# Altium project panel_led.PrjPcb
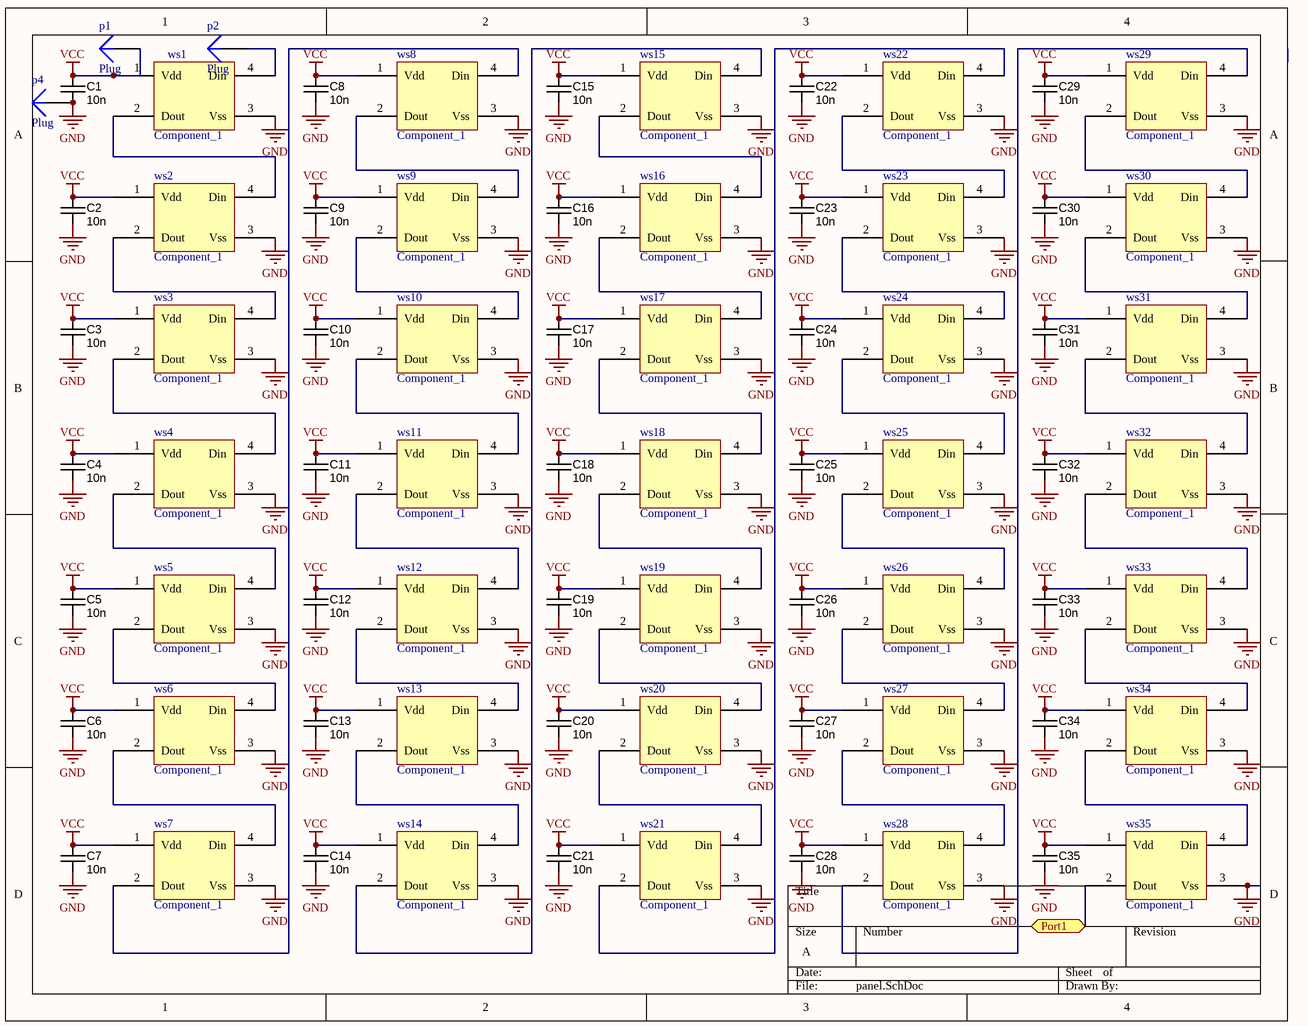
[diagram p0: panel.SchDoc]
7 sheets, 460 parts. Net scope: flat (ports and power ports of the same name join across sheets).
Board file: panel_led.PcbDoc
Sheets:
  panel.SchDoc
  panel2.SchDoc
  panel3.SchDoc
  panel4.SchDoc
  panel5.SchDoc
  panel6.SchDoc
  panel7.SchDoc

## Sheet panel.SchDoc
size A

### Parts
C1  value 10n  [CAPC1608X90N]  (hidden comment: approved sub OK)
C2  value 10n  [CAPC1608X90N]  (hidden comment: approved sub OK)
C3  value 10n  [CAPC1608X90N]  (hidden comment: approved sub OK)
C4  value 10n  [CAPC1608X90N]  (hidden comment: approved sub OK)
C5  value 10n  [CAPC1608X90N]  (hidden comment: approved sub OK)
C6  value 10n  [CAPC1608X90N]  (hidden comment: approved sub OK)
C7  value 10n  [CAPC1608X90N]  (hidden comment: approved sub OK)
C8  value 10n  [CAPC1608X90N]  (hidden comment: approved sub OK)
C9  value 10n  [CAPC1608X90N]  (hidden comment: approved sub OK)
C10  value 10n  [CAPC1608X90N]  (hidden comment: approved sub OK)
C11  value 10n  [CAPC1608X90N]  (hidden comment: approved sub OK)
C12  value 10n  [CAPC1608X90N]  (hidden comment: approved sub OK)
C13  value 10n  [CAPC1608X90N]  (hidden comment: approved sub OK)
C14  value 10n  [CAPC1608X90N]  (hidden comment: approved sub OK)
C15  value 10n  [CAPC1608X90N]  (hidden comment: approved sub OK)
C16  value 10n  [CAPC1608X90N]  (hidden comment: approved sub OK)
C17  value 10n  [CAPC1608X90N]  (hidden comment: approved sub OK)
C18  value 10n  [CAPC1608X90N]  (hidden comment: approved sub OK)
C19  value 10n  [CAPC1608X90N]  (hidden comment: approved sub OK)
C20  value 10n  [CAPC1608X90N]  (hidden comment: approved sub OK)
C21  value 10n  [CAPC1608X90N]  (hidden comment: approved sub OK)
C22  value 10n  [CAPC1608X90N]  (hidden comment: approved sub OK)
C23  value 10n  [CAPC1608X90N]  (hidden comment: approved sub OK)
C24  value 10n  [CAPC1608X90N]  (hidden comment: approved sub OK)
C25  value 10n  [CAPC1608X90N]  (hidden comment: approved sub OK)
C26  value 10n  [CAPC1608X90N]  (hidden comment: approved sub OK)
C27  value 10n  [CAPC1608X90N]  (hidden comment: approved sub OK)
C28  value 10n  [CAPC1608X90N]  (hidden comment: approved sub OK)
C29  value 10n  [CAPC1608X90N]  (hidden comment: approved sub OK)
C30  value 10n  [CAPC1608X90N]  (hidden comment: approved sub OK)
C31  value 10n  [CAPC1608X90N]  (hidden comment: approved sub OK)
C32  value 10n  [CAPC1608X90N]  (hidden comment: approved sub OK)
C33  value 10n  [CAPC1608X90N]  (hidden comment: approved sub OK)
C34  value 10n  [CAPC1608X90N]  (hidden comment: approved sub OK)
C35  value 10n  [CAPC1608X90N]  (hidden comment: approved sub OK)
p1  Plug  [PIN1]
p2  Plug  [PIN1]
p4  Plug  [PIN1]
ws1  Component_1  [SOP4]
ws2  Component_1  [SOP4]
ws3  Component_1  [SOP4]
ws4  Component_1  [SOP4]
ws5  Component_1  [SOP4]
ws6  Component_1  [SOP4]
ws7  Component_1  [SOP4]
ws8  Component_1  [SOP4]
ws9  Component_1  [SOP4]
ws10  Component_1  [SOP4]
ws11  Component_1  [SOP4]
ws12  Component_1  [SOP4]
ws13  Component_1  [SOP4]
ws14  Component_1  [SOP4]
ws15  Component_1  [SOP4]
ws16  Component_1  [SOP4]
ws17  Component_1  [SOP4]
ws18  Component_1  [SOP4]
ws19  Component_1  [SOP4]
ws20  Component_1  [SOP4]
ws21  Component_1  [SOP4]
ws22  Component_1  [SOP4]
ws23  Component_1  [SOP4]
ws24  Component_1  [SOP4]
ws25  Component_1  [SOP4]
ws26  Component_1  [SOP4]
ws27  Component_1  [SOP4]
ws28  Component_1  [SOP4]
ws29  Component_1  [SOP4]
ws30  Component_1  [SOP4]
ws31  Component_1  [SOP4]
ws32  Component_1  [SOP4]
ws33  Component_1  [SOP4]
ws34  Component_1  [SOP4]
ws35  Component_1  [SOP4]

### Ports
Port1

### Nets
GND: C1.2 C2.2 C3.2 C4.2 C5.2 C6.2 C7.2 C8.2 C9.2 C10.2 C11.2 C12.2 C13.2 C14.2 C15.2 C16.2 C17.2 C18.2 C19.2 C20.2 C21.2 C22.2 C23.2 C24.2 C25.2 C26.2 C27.2 C28.2 C29.2 C30.2 C31.2 C32.2 C33.2 C34.2 C35.2 p4.1 ws1.3(Vss) ws2.3(Vss) ws3.3(Vss) ws4.3(Vss) ws5.3(Vss) ws6.3(Vss) ws7.3(Vss) ws8.3(Vss) ws9.3(Vss) ws10.3(Vss) ws11.3(Vss) ws12.3(Vss) ws13.3(Vss) ws14.3(Vss) ws15.3(Vss) ws16.3(Vss) ws17.3(Vss) ws18.3(Vss) ws19.3(Vss) ws20.3(Vss) ws21.3(Vss) ws22.3(Vss) ws23.3(Vss) ws24.3(Vss) ws25.3(Vss) ws26.3(Vss) ws27.3(Vss) ws28.3(Vss) ws29.3(Vss) ws30.3(Vss) ws31.3(Vss) ws32.3(Vss) ws33.3(Vss) ws34.3(Vss) ws35.3(Vss)
VCC: C1.1 C2.1 C3.1 C4.1 C5.1 C6.1 C7.1 C8.1 C9.1 C10.1 C11.1 C12.1 C13.1 C14.1 C15.1 C16.1 C17.1 C18.1 C19.1 C20.1 C21.1 C22.1 C23.1 C24.1 C25.1 C26.1 C27.1 C28.1 C29.1 C30.1 C31.1 C32.1 C33.1 C34.1 C35.1 p1.1 ws1.1(Vdd) ws2.1(Vdd) ws3.1(Vdd) ws4.1(Vdd) ws5.1(Vdd) ws6.1(Vdd) ws7.1(Vdd) ws8.1(Vdd) ws9.1(Vdd) ws10.1(Vdd) ws11.1(Vdd) ws12.1(Vdd) ws13.1(Vdd) ws14.1(Vdd) ws15.1(Vdd) ws16.1(Vdd) ws17.1(Vdd) ws18.1(Vdd) ws19.1(Vdd) ws20.1(Vdd) ws21.1(Vdd) ws22.1(Vdd) ws23.1(Vdd) ws24.1(Vdd) ws25.1(Vdd) ws26.1(Vdd) ws27.1(Vdd) ws28.1(Vdd) ws29.1(Vdd) ws30.1(Vdd) ws31.1(Vdd) ws32.1(Vdd) ws33.1(Vdd) ws34.1(Vdd) ws35.1(Vdd)
Netp2_1: p2.1 ws1.4(Din)
Netws1_2: ws1.2(Dout) ws2.4(Din)
Netws2_2: ws2.2(Dout) ws3.4(Din)
Netws3_2: ws3.2(Dout) ws4.4(Din)
Netws4_2: ws4.2(Dout) ws5.4(Din)
Netws5_2: ws5.2(Dout) ws6.4(Din)
Netws6_2: ws6.2(Dout) ws7.4(Din)
Netws7_2: ws7.2(Dout) ws8.4(Din)
Netws8_2: ws8.2(Dout) ws9.4(Din)
Netws9_2: ws9.2(Dout) ws10.4(Din)
Netws10_2: ws10.2(Dout) ws11.4(Din)
Netws11_2: ws11.2(Dout) ws12.4(Din)
Netws12_2: ws12.2(Dout) ws13.4(Din)
Netws13_2: ws13.2(Dout) ws14.4(Din)
Netws14_2: ws14.2(Dout) ws15.4(Din)
Netws15_2: ws15.2(Dout) ws16.4(Din)
Netws16_2: ws16.2(Dout) ws17.4(Din)
Netws17_2: ws17.2(Dout) ws18.4(Din)
Netws18_2: ws18.2(Dout) ws19.4(Din)
Netws19_2: ws19.2(Dout) ws20.4(Din)
Netws20_2: ws20.2(Dout) ws21.4(Din)
Netws21_2: ws21.2(Dout) ws22.4(Din)
Netws22_2: ws22.2(Dout) ws23.4(Din)
Netws23_2: ws23.2(Dout) ws24.4(Din)
Netws24_2: ws24.2(Dout) ws25.4(Din)
Netws25_2: ws25.2(Dout) ws26.4(Din)
Netws26_2: ws26.2(Dout) ws27.4(Din)
Netws27_2: ws27.2(Dout) ws28.4(Din)
Netws28_2: ws28.2(Dout) ws29.4(Din)
Netws29_2: ws29.2(Dout) ws30.4(Din)
Netws30_2: ws30.2(Dout) ws31.4(Din)
Netws31_2: ws31.2(Dout) ws32.4(Din)
Netws32_2: ws32.2(Dout) ws33.4(Din)
Netws33_2: ws33.2(Dout) ws34.4(Din)
Netws34_2: ws34.2(Dout) ws35.4(Din)
Netws35_2: ws35.2(Dout) ; port Port1

### Library data of the parts
C1-C35 = CAPC_10n_0603_X7R_100V_10%: Capacitor SMD Cer 10nF 10% 100V X7R 0603; Manufacturer: Murata Electronics North America; Manufacturer Part Number: GCM188R72A103KA37D; Ratings: 100V; X7R; Material: ceramic; SCDType: undef; Package / Case: 0603 (1608 metric); Tolerance: ±10%; Supplier 1: Digi-Key; Supplier Part Number 1: 490-4781-1-ND
p1 p2 p4 = Plug: LatestRevisionDate: 17-Jul-2002; LatestRevisionNote: Re-released for DXP Platform.; Publisher: Altium Limited

## Sheet panel2.SchDoc
size A
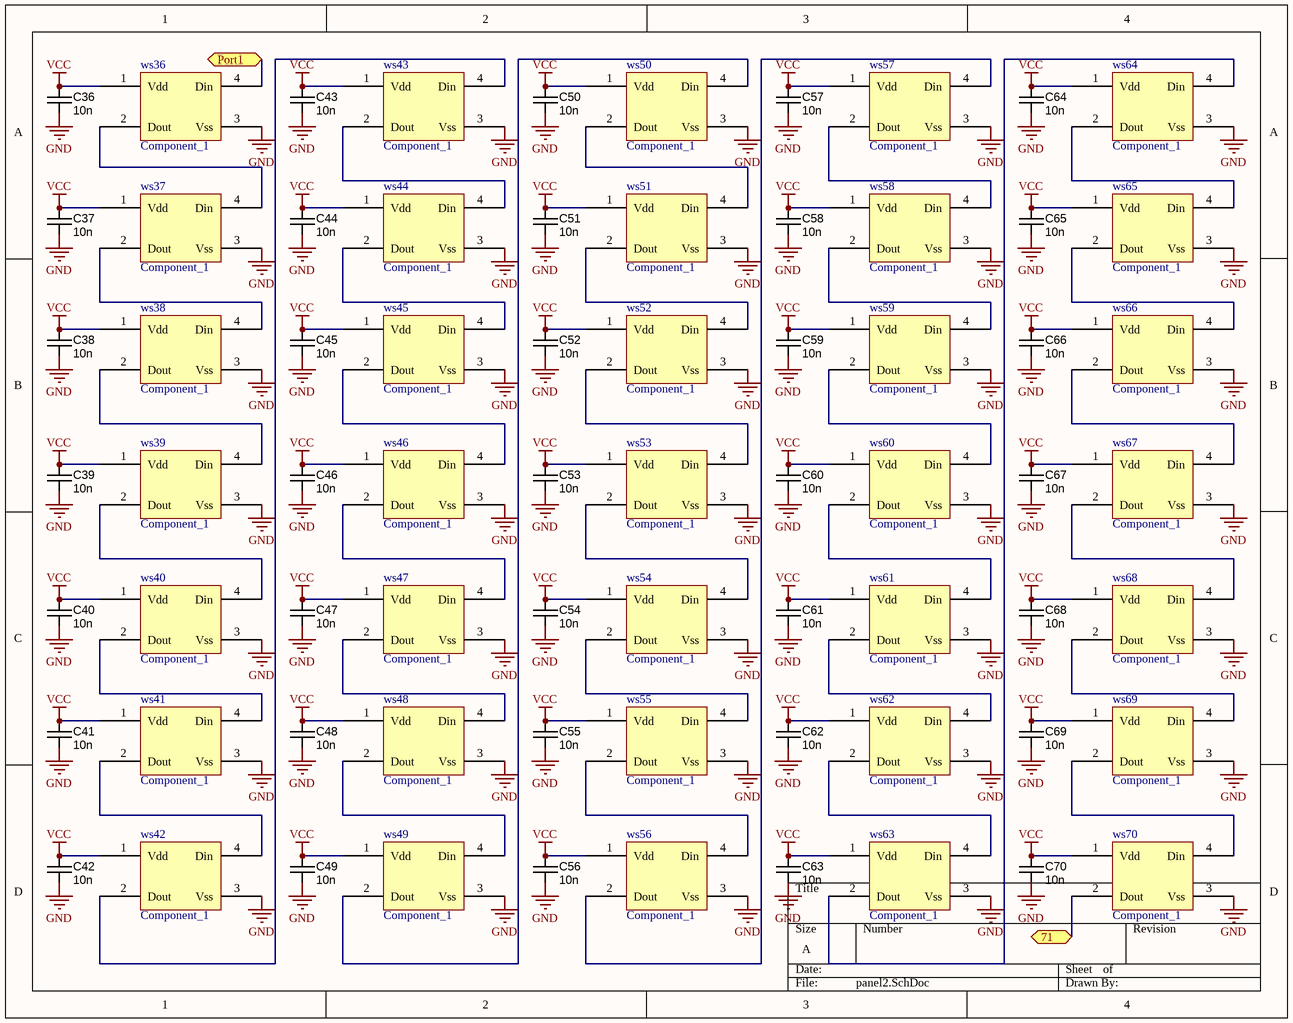
[diagram p1: panel2.SchDoc]

### Parts
C36  value 10n  [CAPC1608X90N]  (hidden comment: approved sub OK)
C37  value 10n  [CAPC1608X90N]  (hidden comment: approved sub OK)
C38  value 10n  [CAPC1608X90N]  (hidden comment: approved sub OK)
C39  value 10n  [CAPC1608X90N]  (hidden comment: approved sub OK)
C40  value 10n  [CAPC1608X90N]  (hidden comment: approved sub OK)
C41  value 10n  [CAPC1608X90N]  (hidden comment: approved sub OK)
C42  value 10n  [CAPC1608X90N]  (hidden comment: approved sub OK)
C43  value 10n  [CAPC1608X90N]  (hidden comment: approved sub OK)
C44  value 10n  [CAPC1608X90N]  (hidden comment: approved sub OK)
C45  value 10n  [CAPC1608X90N]  (hidden comment: approved sub OK)
C46  value 10n  [CAPC1608X90N]  (hidden comment: approved sub OK)
C47  value 10n  [CAPC1608X90N]  (hidden comment: approved sub OK)
C48  value 10n  [CAPC1608X90N]  (hidden comment: approved sub OK)
C49  value 10n  [CAPC1608X90N]  (hidden comment: approved sub OK)
C50  value 10n  [CAPC1608X90N]  (hidden comment: approved sub OK)
C51  value 10n  [CAPC1608X90N]  (hidden comment: approved sub OK)
C52  value 10n  [CAPC1608X90N]  (hidden comment: approved sub OK)
C53  value 10n  [CAPC1608X90N]  (hidden comment: approved sub OK)
C54  value 10n  [CAPC1608X90N]  (hidden comment: approved sub OK)
C55  value 10n  [CAPC1608X90N]  (hidden comment: approved sub OK)
C56  value 10n  [CAPC1608X90N]  (hidden comment: approved sub OK)
C57  value 10n  [CAPC1608X90N]  (hidden comment: approved sub OK)
C58  value 10n  [CAPC1608X90N]  (hidden comment: approved sub OK)
C59  value 10n  [CAPC1608X90N]  (hidden comment: approved sub OK)
C60  value 10n  [CAPC1608X90N]  (hidden comment: approved sub OK)
C61  value 10n  [CAPC1608X90N]  (hidden comment: approved sub OK)
C62  value 10n  [CAPC1608X90N]  (hidden comment: approved sub OK)
C63  value 10n  [CAPC1608X90N]  (hidden comment: approved sub OK)
C64  value 10n  [CAPC1608X90N]  (hidden comment: approved sub OK)
C65  value 10n  [CAPC1608X90N]  (hidden comment: approved sub OK)
C66  value 10n  [CAPC1608X90N]  (hidden comment: approved sub OK)
C67  value 10n  [CAPC1608X90N]  (hidden comment: approved sub OK)
C68  value 10n  [CAPC1608X90N]  (hidden comment: approved sub OK)
C69  value 10n  [CAPC1608X90N]  (hidden comment: approved sub OK)
C70  value 10n  [CAPC1608X90N]  (hidden comment: approved sub OK)
ws36  Component_1  [SOP4]
ws37  Component_1  [SOP4]
ws38  Component_1  [SOP4]
ws39  Component_1  [SOP4]
ws40  Component_1  [SOP4]
ws41  Component_1  [SOP4]
ws42  Component_1  [SOP4]
ws43  Component_1  [SOP4]
ws44  Component_1  [SOP4]
ws45  Component_1  [SOP4]
ws46  Component_1  [SOP4]
ws47  Component_1  [SOP4]
ws48  Component_1  [SOP4]
ws49  Component_1  [SOP4]
ws50  Component_1  [SOP4]
ws51  Component_1  [SOP4]
ws52  Component_1  [SOP4]
ws53  Component_1  [SOP4]
ws54  Component_1  [SOP4]
ws55  Component_1  [SOP4]
ws56  Component_1  [SOP4]
ws57  Component_1  [SOP4]
ws58  Component_1  [SOP4]
ws59  Component_1  [SOP4]
ws60  Component_1  [SOP4]
ws61  Component_1  [SOP4]
ws62  Component_1  [SOP4]
ws63  Component_1  [SOP4]
ws64  Component_1  [SOP4]
ws65  Component_1  [SOP4]
ws66  Component_1  [SOP4]
ws67  Component_1  [SOP4]
ws68  Component_1  [SOP4]
ws69  Component_1  [SOP4]
ws70  Component_1  [SOP4]

### Ports
71, Port1

### Nets
GND: C36.2 C37.2 C38.2 C39.2 C40.2 C41.2 C42.2 C43.2 C44.2 C45.2 C46.2 C47.2 C48.2 C49.2 C50.2 C51.2 C52.2 C53.2 C54.2 C55.2 C56.2 C57.2 C58.2 C59.2 C60.2 C61.2 C62.2 C63.2 C64.2 C65.2 C66.2 C67.2 C68.2 C69.2 C70.2 ws36.3(Vss) ws37.3(Vss) ws38.3(Vss) ws39.3(Vss) ws40.3(Vss) ws41.3(Vss) ws42.3(Vss) ws43.3(Vss) ws44.3(Vss) ws45.3(Vss) ws46.3(Vss) ws47.3(Vss) ws48.3(Vss) ws49.3(Vss) ws50.3(Vss) ws51.3(Vss) ws52.3(Vss) ws53.3(Vss) ws54.3(Vss) ws55.3(Vss) ws56.3(Vss) ws57.3(Vss) ws58.3(Vss) ws59.3(Vss) ws60.3(Vss) ws61.3(Vss) ws62.3(Vss) ws63.3(Vss) ws64.3(Vss) ws65.3(Vss) ws66.3(Vss) ws67.3(Vss) ws68.3(Vss) ws69.3(Vss) ws70.3(Vss)
VCC: C36.1 C37.1 C38.1 C39.1 C40.1 C41.1 C42.1 C43.1 C44.1 C45.1 C46.1 C47.1 C48.1 C49.1 C50.1 C51.1 C52.1 C53.1 C54.1 C55.1 C56.1 C57.1 C58.1 C59.1 C60.1 C61.1 C62.1 C63.1 C64.1 C65.1 C66.1 C67.1 C68.1 C69.1 C70.1 ws36.1(Vdd) ws37.1(Vdd) ws38.1(Vdd) ws39.1(Vdd) ws40.1(Vdd) ws41.1(Vdd) ws42.1(Vdd) ws43.1(Vdd) ws44.1(Vdd) ws45.1(Vdd) ws46.1(Vdd) ws47.1(Vdd) ws48.1(Vdd) ws49.1(Vdd) ws50.1(Vdd) ws51.1(Vdd) ws52.1(Vdd) ws53.1(Vdd) ws54.1(Vdd) ws55.1(Vdd) ws56.1(Vdd) ws57.1(Vdd) ws58.1(Vdd) ws59.1(Vdd) ws60.1(Vdd) ws61.1(Vdd) ws62.1(Vdd) ws63.1(Vdd) ws64.1(Vdd) ws65.1(Vdd) ws66.1(Vdd) ws67.1(Vdd) ws68.1(Vdd) ws69.1(Vdd) ws70.1(Vdd)
Netws35_2: ws36.4(Din) ; port Port1
Netws36_2: ws36.2(Dout) ws37.4(Din)
Netws37_2: ws37.2(Dout) ws38.4(Din)
Netws38_2: ws38.2(Dout) ws39.4(Din)
Netws39_2: ws39.2(Dout) ws40.4(Din)
Netws40_2: ws40.2(Dout) ws41.4(Din)
Netws41_2: ws41.2(Dout) ws42.4(Din)
Netws42_2: ws42.2(Dout) ws43.4(Din)
Netws43_2: ws43.2(Dout) ws44.4(Din)
Netws44_2: ws44.2(Dout) ws45.4(Din)
Netws45_2: ws45.2(Dout) ws46.4(Din)
Netws46_2: ws46.2(Dout) ws47.4(Din)
Netws47_2: ws47.2(Dout) ws48.4(Din)
Netws48_2: ws48.2(Dout) ws49.4(Din)
Netws49_2: ws49.2(Dout) ws50.4(Din)
Netws50_2: ws50.2(Dout) ws51.4(Din)
Netws51_2: ws51.2(Dout) ws52.4(Din)
Netws52_2: ws52.2(Dout) ws53.4(Din)
Netws53_2: ws53.2(Dout) ws54.4(Din)
Netws54_2: ws54.2(Dout) ws55.4(Din)
Netws55_2: ws55.2(Dout) ws56.4(Din)
Netws56_2: ws56.2(Dout) ws57.4(Din)
Netws57_2: ws57.2(Dout) ws58.4(Din)
Netws58_2: ws58.2(Dout) ws59.4(Din)
Netws59_2: ws59.2(Dout) ws60.4(Din)
Netws60_2: ws60.2(Dout) ws61.4(Din)
Netws61_2: ws61.2(Dout) ws62.4(Din)
Netws62_2: ws62.2(Dout) ws63.4(Din)
Netws63_2: ws63.2(Dout) ws64.4(Din)
Netws64_2: ws64.2(Dout) ws65.4(Din)
Netws65_2: ws65.2(Dout) ws66.4(Din)
Netws66_2: ws66.2(Dout) ws67.4(Din)
Netws67_2: ws67.2(Dout) ws68.4(Din)
Netws68_2: ws68.2(Dout) ws69.4(Din)
Netws69_2: ws69.2(Dout) ws70.4(Din)
Netws70_2: ws70.2(Dout) ; port 71

### Library data of the parts
C36-C70 = CAPC_10n_0603_X7R_100V_10%: as C1 on sheet panel; Package / Case: 0603 (1608 metric); Tolerance: ±10%; Supplier 1: Digi-Key; Supplier Part Number 1: 490-4781-1-ND

## Sheet panel3.SchDoc
size A
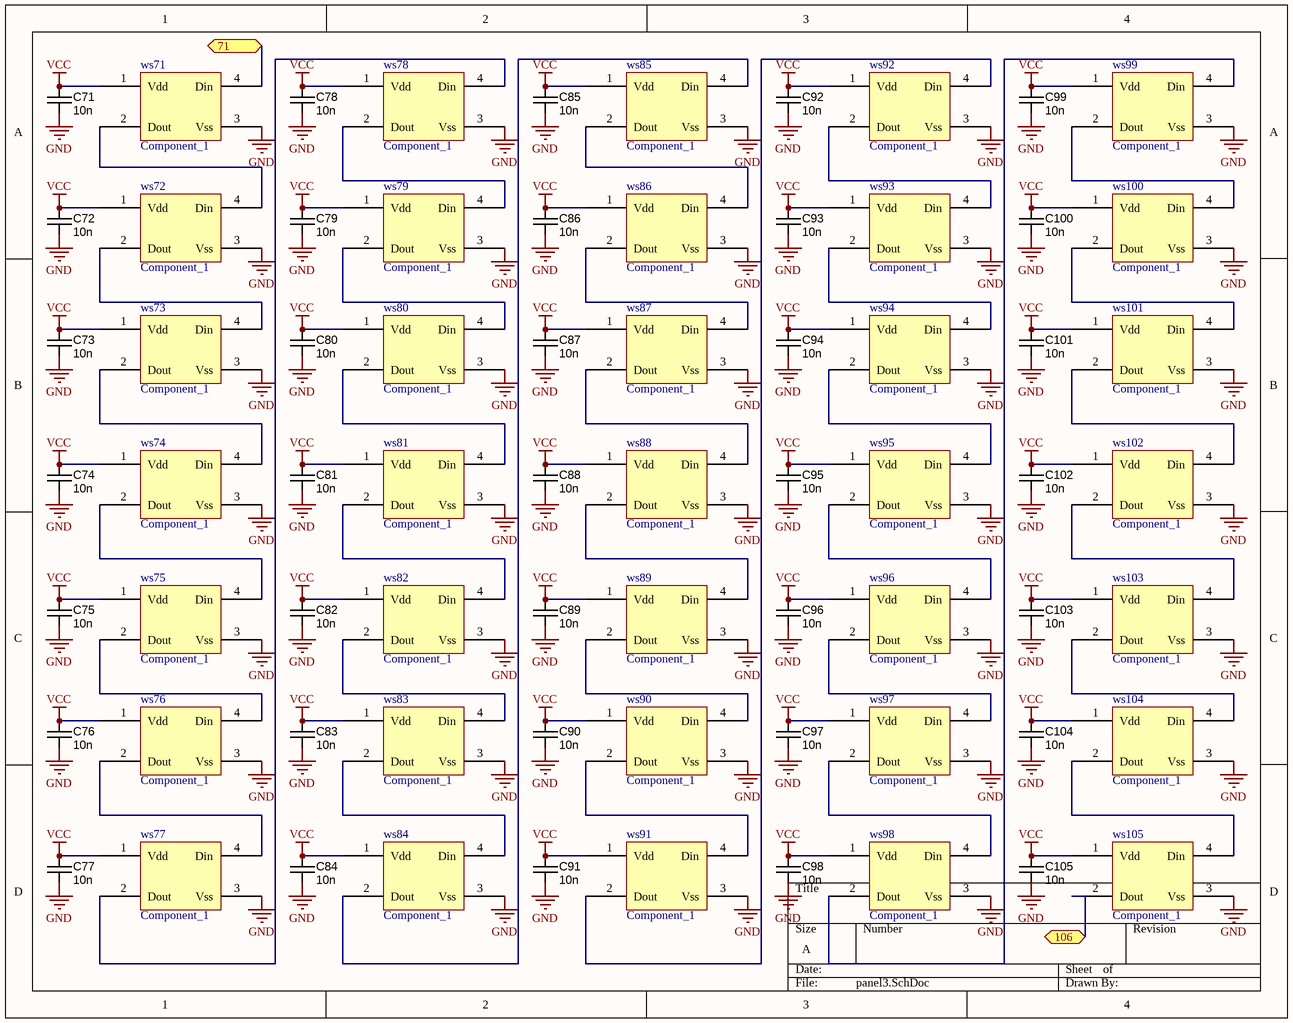
[diagram p2: panel3.SchDoc]

### Parts
C71  value 10n  [CAPC1608X90N]  (hidden comment: approved sub OK)
C72  value 10n  [CAPC1608X90N]  (hidden comment: approved sub OK)
C73  value 10n  [CAPC1608X90N]  (hidden comment: approved sub OK)
C74  value 10n  [CAPC1608X90N]  (hidden comment: approved sub OK)
C75  value 10n  [CAPC1608X90N]  (hidden comment: approved sub OK)
C76  value 10n  [CAPC1608X90N]  (hidden comment: approved sub OK)
C77  value 10n  [CAPC1608X90N]  (hidden comment: approved sub OK)
C78  value 10n  [CAPC1608X90N]  (hidden comment: approved sub OK)
C79  value 10n  [CAPC1608X90N]  (hidden comment: approved sub OK)
C80  value 10n  [CAPC1608X90N]  (hidden comment: approved sub OK)
C81  value 10n  [CAPC1608X90N]  (hidden comment: approved sub OK)
C82  value 10n  [CAPC1608X90N]  (hidden comment: approved sub OK)
C83  value 10n  [CAPC1608X90N]  (hidden comment: approved sub OK)
C84  value 10n  [CAPC1608X90N]  (hidden comment: approved sub OK)
C85  value 10n  [CAPC1608X90N]  (hidden comment: approved sub OK)
C86  value 10n  [CAPC1608X90N]  (hidden comment: approved sub OK)
C87  value 10n  [CAPC1608X90N]  (hidden comment: approved sub OK)
C88  value 10n  [CAPC1608X90N]  (hidden comment: approved sub OK)
C89  value 10n  [CAPC1608X90N]  (hidden comment: approved sub OK)
C90  value 10n  [CAPC1608X90N]  (hidden comment: approved sub OK)
C91  value 10n  [CAPC1608X90N]  (hidden comment: approved sub OK)
C92  value 10n  [CAPC1608X90N]  (hidden comment: approved sub OK)
C93  value 10n  [CAPC1608X90N]  (hidden comment: approved sub OK)
C94  value 10n  [CAPC1608X90N]  (hidden comment: approved sub OK)
C95  value 10n  [CAPC1608X90N]  (hidden comment: approved sub OK)
C96  value 10n  [CAPC1608X90N]  (hidden comment: approved sub OK)
C97  value 10n  [CAPC1608X90N]  (hidden comment: approved sub OK)
C98  value 10n  [CAPC1608X90N]  (hidden comment: approved sub OK)
C99  value 10n  [CAPC1608X90N]  (hidden comment: approved sub OK)
C100  value 10n  [CAPC1608X90N]  (hidden comment: approved sub OK)
C101  value 10n  [CAPC1608X90N]  (hidden comment: approved sub OK)
C102  value 10n  [CAPC1608X90N]  (hidden comment: approved sub OK)
C103  value 10n  [CAPC1608X90N]  (hidden comment: approved sub OK)
C104  value 10n  [CAPC1608X90N]  (hidden comment: approved sub OK)
C105  value 10n  [CAPC1608X90N]  (hidden comment: approved sub OK)
ws71  Component_1  [SOP4]
ws72  Component_1  [SOP4]
ws73  Component_1  [SOP4]
ws74  Component_1  [SOP4]
ws75  Component_1  [SOP4]
ws76  Component_1  [SOP4]
ws77  Component_1  [SOP4]
ws78  Component_1  [SOP4]
ws79  Component_1  [SOP4]
ws80  Component_1  [SOP4]
ws81  Component_1  [SOP4]
ws82  Component_1  [SOP4]
ws83  Component_1  [SOP4]
ws84  Component_1  [SOP4]
ws85  Component_1  [SOP4]
ws86  Component_1  [SOP4]
ws87  Component_1  [SOP4]
ws88  Component_1  [SOP4]
ws89  Component_1  [SOP4]
ws90  Component_1  [SOP4]
ws91  Component_1  [SOP4]
ws92  Component_1  [SOP4]
ws93  Component_1  [SOP4]
ws94  Component_1  [SOP4]
ws95  Component_1  [SOP4]
ws96  Component_1  [SOP4]
ws97  Component_1  [SOP4]
ws98  Component_1  [SOP4]
ws99  Component_1  [SOP4]
ws100  Component_1  [SOP4]
ws101  Component_1  [SOP4]
ws102  Component_1  [SOP4]
ws103  Component_1  [SOP4]
ws104  Component_1  [SOP4]
ws105  Component_1  [SOP4]

### Ports
71, 106

### Nets
GND: C71.2 C72.2 C73.2 C74.2 C75.2 C76.2 C77.2 C78.2 C79.2 C80.2 C81.2 C82.2 C83.2 C84.2 C85.2 C86.2 C87.2 C88.2 C89.2 C90.2 C91.2 C92.2 C93.2 C94.2 C95.2 C96.2 C97.2 C98.2 C99.2 C100.2 C101.2 C102.2 C103.2 C104.2 C105.2 ws71.3(Vss) ws72.3(Vss) ws73.3(Vss) ws74.3(Vss) ws75.3(Vss) ws76.3(Vss) ws77.3(Vss) ws78.3(Vss) ws79.3(Vss) ws80.3(Vss) ws81.3(Vss) ws82.3(Vss) ws83.3(Vss) ws84.3(Vss) ws85.3(Vss) ws86.3(Vss) ws87.3(Vss) ws88.3(Vss) ws89.3(Vss) ws90.3(Vss) ws91.3(Vss) ws92.3(Vss) ws93.3(Vss) ws94.3(Vss) ws95.3(Vss) ws96.3(Vss) ws97.3(Vss) ws98.3(Vss) ws99.3(Vss) ws100.3(Vss) ws101.3(Vss) ws102.3(Vss) ws103.3(Vss) ws104.3(Vss) ws105.3(Vss)
VCC: C71.1 C72.1 C73.1 C74.1 C75.1 C76.1 C77.1 C78.1 C79.1 C80.1 C81.1 C82.1 C83.1 C84.1 C85.1 C86.1 C87.1 C88.1 C89.1 C90.1 C91.1 C92.1 C93.1 C94.1 C95.1 C96.1 C97.1 C98.1 C99.1 C100.1 C101.1 C102.1 C103.1 C104.1 C105.1 ws71.1(Vdd) ws72.1(Vdd) ws73.1(Vdd) ws74.1(Vdd) ws75.1(Vdd) ws76.1(Vdd) ws77.1(Vdd) ws78.1(Vdd) ws79.1(Vdd) ws80.1(Vdd) ws81.1(Vdd) ws82.1(Vdd) ws83.1(Vdd) ws84.1(Vdd) ws85.1(Vdd) ws86.1(Vdd) ws87.1(Vdd) ws88.1(Vdd) ws89.1(Vdd) ws90.1(Vdd) ws91.1(Vdd) ws92.1(Vdd) ws93.1(Vdd) ws94.1(Vdd) ws95.1(Vdd) ws96.1(Vdd) ws97.1(Vdd) ws98.1(Vdd) ws99.1(Vdd) ws100.1(Vdd) ws101.1(Vdd) ws102.1(Vdd) ws103.1(Vdd) ws104.1(Vdd) ws105.1(Vdd)
Netws70_2: ws71.4(Din) ; port 71
Netws71_2: ws71.2(Dout) ws72.4(Din)
Netws72_2: ws72.2(Dout) ws73.4(Din)
Netws73_2: ws73.2(Dout) ws74.4(Din)
Netws74_2: ws74.2(Dout) ws75.4(Din)
Netws75_2: ws75.2(Dout) ws76.4(Din)
Netws76_2: ws76.2(Dout) ws77.4(Din)
Netws77_2: ws77.2(Dout) ws78.4(Din)
Netws78_2: ws78.2(Dout) ws79.4(Din)
Netws79_2: ws79.2(Dout) ws80.4(Din)
Netws80_2: ws80.2(Dout) ws81.4(Din)
Netws81_2: ws81.2(Dout) ws82.4(Din)
Netws82_2: ws82.2(Dout) ws83.4(Din)
Netws83_2: ws83.2(Dout) ws84.4(Din)
Netws84_2: ws84.2(Dout) ws85.4(Din)
Netws85_2: ws85.2(Dout) ws86.4(Din)
Netws86_2: ws86.2(Dout) ws87.4(Din)
Netws87_2: ws87.2(Dout) ws88.4(Din)
Netws88_2: ws88.2(Dout) ws89.4(Din)
Netws89_2: ws89.2(Dout) ws90.4(Din)
Netws90_2: ws90.2(Dout) ws91.4(Din)
Netws91_2: ws91.2(Dout) ws92.4(Din)
Netws92_2: ws92.2(Dout) ws93.4(Din)
Netws93_2: ws93.2(Dout) ws94.4(Din)
Netws94_2: ws94.2(Dout) ws95.4(Din)
Netws95_2: ws95.2(Dout) ws96.4(Din)
Netws96_2: ws96.2(Dout) ws97.4(Din)
Netws97_2: ws97.2(Dout) ws98.4(Din)
Netws98_2: ws98.2(Dout) ws99.4(Din)
Netws99_2: ws99.2(Dout) ws100.4(Din)
Netws100_2: ws100.2(Dout) ws101.4(Din)
Netws101_2: ws101.2(Dout) ws102.4(Din)
Netws102_2: ws102.2(Dout) ws103.4(Din)
Netws103_2: ws103.2(Dout) ws104.4(Din)
Netws104_2: ws104.2(Dout) ws105.4(Din)
Netws105_2: ws105.2(Dout) ; port 106

### Library data of the parts
C71-C105 = CAPC_10n_0603_X7R_100V_10%: as C1 on sheet panel; Package / Case: 0603 (1608 metric); Tolerance: ±10%; Supplier 1: Digi-Key; Supplier Part Number 1: 490-4781-1-ND

## Sheet panel4.SchDoc
size A
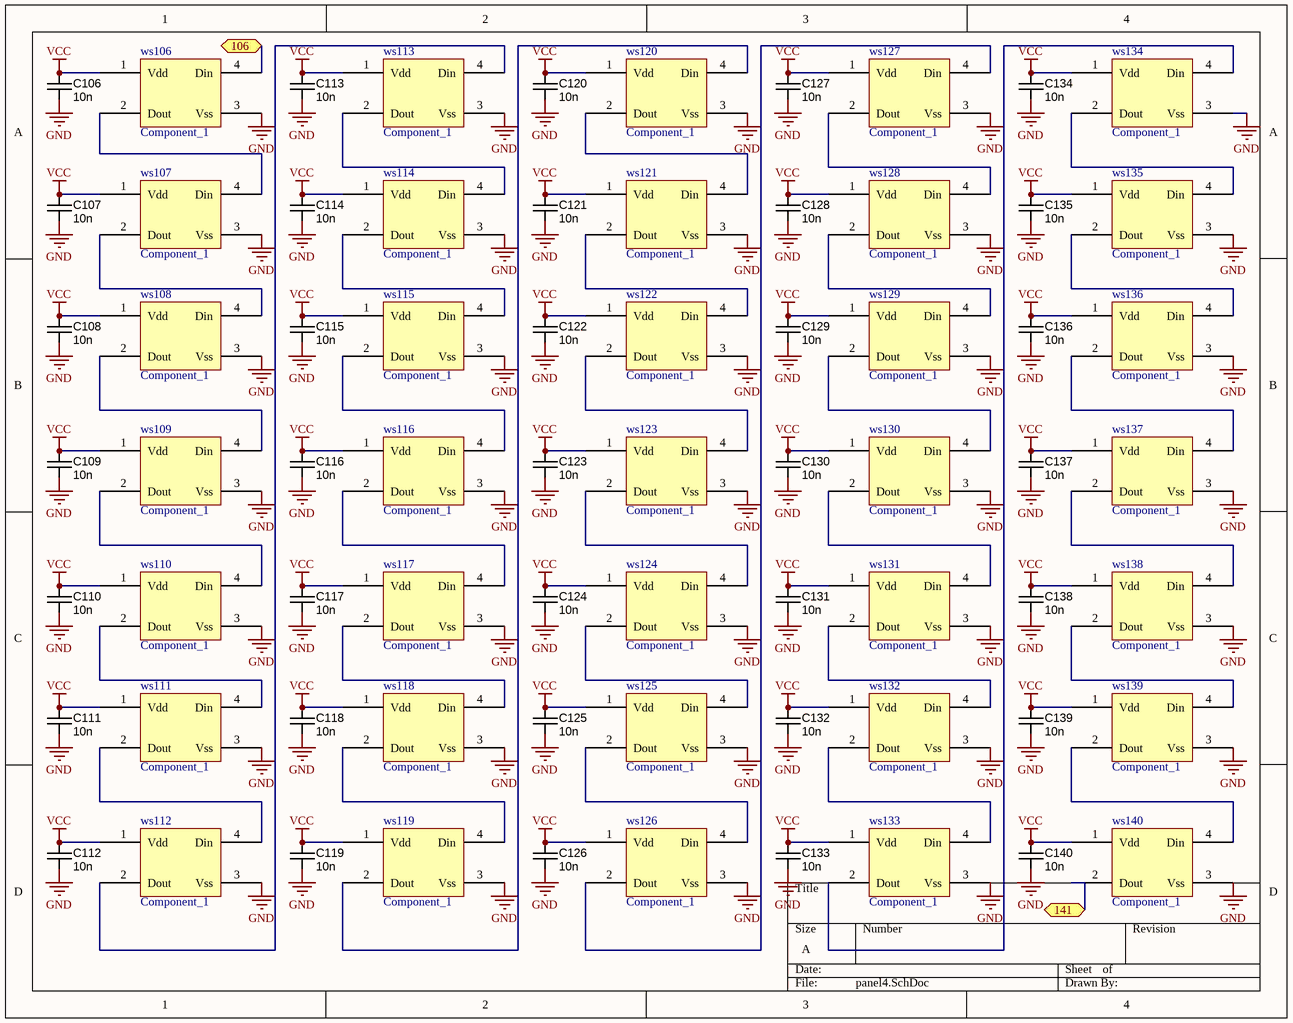
[diagram p3: panel4.SchDoc]

### Parts
C106  value 10n  [CAPC1608X90N]  (hidden comment: approved sub OK)
C107  value 10n  [CAPC1608X90N]  (hidden comment: approved sub OK)
C108  value 10n  [CAPC1608X90N]  (hidden comment: approved sub OK)
C109  value 10n  [CAPC1608X90N]  (hidden comment: approved sub OK)
C110  value 10n  [CAPC1608X90N]  (hidden comment: approved sub OK)
C111  value 10n  [CAPC1608X90N]  (hidden comment: approved sub OK)
C112  value 10n  [CAPC1608X90N]  (hidden comment: approved sub OK)
C113  value 10n  [CAPC1608X90N]  (hidden comment: approved sub OK)
C114  value 10n  [CAPC1608X90N]  (hidden comment: approved sub OK)
C115  value 10n  [CAPC1608X90N]  (hidden comment: approved sub OK)
C116  value 10n  [CAPC1608X90N]  (hidden comment: approved sub OK)
C117  value 10n  [CAPC1608X90N]  (hidden comment: approved sub OK)
C118  value 10n  [CAPC1608X90N]  (hidden comment: approved sub OK)
C119  value 10n  [CAPC1608X90N]  (hidden comment: approved sub OK)
C120  value 10n  [CAPC1608X90N]  (hidden comment: approved sub OK)
C121  value 10n  [CAPC1608X90N]  (hidden comment: approved sub OK)
C122  value 10n  [CAPC1608X90N]  (hidden comment: approved sub OK)
C123  value 10n  [CAPC1608X90N]  (hidden comment: approved sub OK)
C124  value 10n  [CAPC1608X90N]  (hidden comment: approved sub OK)
C125  value 10n  [CAPC1608X90N]  (hidden comment: approved sub OK)
C126  value 10n  [CAPC1608X90N]  (hidden comment: approved sub OK)
C127  value 10n  [CAPC1608X90N]  (hidden comment: approved sub OK)
C128  value 10n  [CAPC1608X90N]  (hidden comment: approved sub OK)
C129  value 10n  [CAPC1608X90N]  (hidden comment: approved sub OK)
C130  value 10n  [CAPC1608X90N]  (hidden comment: approved sub OK)
C131  value 10n  [CAPC1608X90N]  (hidden comment: approved sub OK)
C132  value 10n  [CAPC1608X90N]  (hidden comment: approved sub OK)
C133  value 10n  [CAPC1608X90N]  (hidden comment: approved sub OK)
C134  value 10n  [CAPC1608X90N]  (hidden comment: approved sub OK)
C135  value 10n  [CAPC1608X90N]  (hidden comment: approved sub OK)
C136  value 10n  [CAPC1608X90N]  (hidden comment: approved sub OK)
C137  value 10n  [CAPC1608X90N]  (hidden comment: approved sub OK)
C138  value 10n  [CAPC1608X90N]  (hidden comment: approved sub OK)
C139  value 10n  [CAPC1608X90N]  (hidden comment: approved sub OK)
C140  value 10n  [CAPC1608X90N]  (hidden comment: approved sub OK)
ws106  Component_1  [SOP4]
ws107  Component_1  [SOP4]
ws108  Component_1  [SOP4]
ws109  Component_1  [SOP4]
ws110  Component_1  [SOP4]
ws111  Component_1  [SOP4]
ws112  Component_1  [SOP4]
ws113  Component_1  [SOP4]
ws114  Component_1  [SOP4]
ws115  Component_1  [SOP4]
ws116  Component_1  [SOP4]
ws117  Component_1  [SOP4]
ws118  Component_1  [SOP4]
ws119  Component_1  [SOP4]
ws120  Component_1  [SOP4]
ws121  Component_1  [SOP4]
ws122  Component_1  [SOP4]
ws123  Component_1  [SOP4]
ws124  Component_1  [SOP4]
ws125  Component_1  [SOP4]
ws126  Component_1  [SOP4]
ws127  Component_1  [SOP4]
ws128  Component_1  [SOP4]
ws129  Component_1  [SOP4]
ws130  Component_1  [SOP4]
ws131  Component_1  [SOP4]
ws132  Component_1  [SOP4]
ws133  Component_1  [SOP4]
ws134  Component_1  [SOP4]
ws135  Component_1  [SOP4]
ws136  Component_1  [SOP4]
ws137  Component_1  [SOP4]
ws138  Component_1  [SOP4]
ws139  Component_1  [SOP4]
ws140  Component_1  [SOP4]

### Ports
106, 141

### Nets
GND: C106.2 C107.2 C108.2 C109.2 C110.2 C111.2 C112.2 C113.2 C114.2 C115.2 C116.2 C117.2 C118.2 C119.2 C120.2 C121.2 C122.2 C123.2 C124.2 C125.2 C126.2 C127.2 C128.2 C129.2 C130.2 C131.2 C132.2 C133.2 C134.2 C135.2 C136.2 C137.2 C138.2 C139.2 C140.2 ws106.3(Vss) ws107.3(Vss) ws108.3(Vss) ws109.3(Vss) ws110.3(Vss) ws111.3(Vss) ws112.3(Vss) ws113.3(Vss) ws114.3(Vss) ws115.3(Vss) ws116.3(Vss) ws117.3(Vss) ws118.3(Vss) ws119.3(Vss) ws120.3(Vss) ws121.3(Vss) ws122.3(Vss) ws123.3(Vss) ws124.3(Vss) ws125.3(Vss) ws126.3(Vss) ws127.3(Vss) ws128.3(Vss) ws129.3(Vss) ws130.3(Vss) ws131.3(Vss) ws132.3(Vss) ws133.3(Vss) ws134.3(Vss) ws135.3(Vss) ws136.3(Vss) ws137.3(Vss) ws138.3(Vss) ws139.3(Vss) ws140.3(Vss)
VCC: C106.1 C107.1 C108.1 C109.1 C110.1 C111.1 C112.1 C113.1 C114.1 C115.1 C116.1 C117.1 C118.1 C119.1 C120.1 C121.1 C122.1 C123.1 C124.1 C125.1 C126.1 C127.1 C128.1 C129.1 C130.1 C131.1 C132.1 C133.1 C134.1 C135.1 C136.1 C137.1 C138.1 C139.1 C140.1 ws106.1(Vdd) ws107.1(Vdd) ws108.1(Vdd) ws109.1(Vdd) ws110.1(Vdd) ws111.1(Vdd) ws112.1(Vdd) ws113.1(Vdd) ws114.1(Vdd) ws115.1(Vdd) ws116.1(Vdd) ws117.1(Vdd) ws118.1(Vdd) ws119.1(Vdd) ws120.1(Vdd) ws121.1(Vdd) ws122.1(Vdd) ws123.1(Vdd) ws124.1(Vdd) ws125.1(Vdd) ws126.1(Vdd) ws127.1(Vdd) ws128.1(Vdd) ws129.1(Vdd) ws130.1(Vdd) ws131.1(Vdd) ws132.1(Vdd) ws133.1(Vdd) ws134.1(Vdd) ws135.1(Vdd) ws136.1(Vdd) ws137.1(Vdd) ws138.1(Vdd) ws139.1(Vdd) ws140.1(Vdd)
Netws105_2: ws106.4(Din) ; port 106
Netws106_2: ws106.2(Dout) ws107.4(Din)
Netws107_2: ws107.2(Dout) ws108.4(Din)
Netws108_2: ws108.2(Dout) ws109.4(Din)
Netws109_2: ws109.2(Dout) ws110.4(Din)
Netws110_2: ws110.2(Dout) ws111.4(Din)
Netws111_2: ws111.2(Dout) ws112.4(Din)
Netws112_2: ws112.2(Dout) ws113.4(Din)
Netws113_2: ws113.2(Dout) ws114.4(Din)
Netws114_2: ws114.2(Dout) ws115.4(Din)
Netws115_2: ws115.2(Dout) ws116.4(Din)
Netws116_2: ws116.2(Dout) ws117.4(Din)
Netws117_2: ws117.2(Dout) ws118.4(Din)
Netws118_2: ws118.2(Dout) ws119.4(Din)
Netws119_2: ws119.2(Dout) ws120.4(Din)
Netws120_2: ws120.2(Dout) ws121.4(Din)
Netws121_2: ws121.2(Dout) ws122.4(Din)
Netws122_2: ws122.2(Dout) ws123.4(Din)
Netws123_2: ws123.2(Dout) ws124.4(Din)
Netws124_2: ws124.2(Dout) ws125.4(Din)
Netws125_2: ws125.2(Dout) ws126.4(Din)
Netws126_2: ws126.2(Dout) ws127.4(Din)
Netws127_2: ws127.2(Dout) ws128.4(Din)
Netws128_2: ws128.2(Dout) ws129.4(Din)
Netws129_2: ws129.2(Dout) ws130.4(Din)
Netws130_2: ws130.2(Dout) ws131.4(Din)
Netws131_2: ws131.2(Dout) ws132.4(Din)
Netws132_2: ws132.2(Dout) ws133.4(Din)
Netws133_2: ws133.2(Dout) ws134.4(Din)
Netws134_2: ws134.2(Dout) ws135.4(Din)
Netws135_2: ws135.2(Dout) ws136.4(Din)
Netws136_2: ws136.2(Dout) ws137.4(Din)
Netws137_2: ws137.2(Dout) ws138.4(Din)
Netws138_2: ws138.2(Dout) ws139.4(Din)
Netws139_2: ws139.2(Dout) ws140.4(Din)
Netws140_2: ws140.2(Dout) ; port 141

### Library data of the parts
C106-C140 = CAPC_10n_0603_X7R_100V_10%: as C1 on sheet panel; Package / Case: 0603 (1608 metric); Tolerance: ±10%; Supplier 1: Digi-Key; Supplier Part Number 1: 490-4781-1-ND

## Sheet panel5.SchDoc
size A
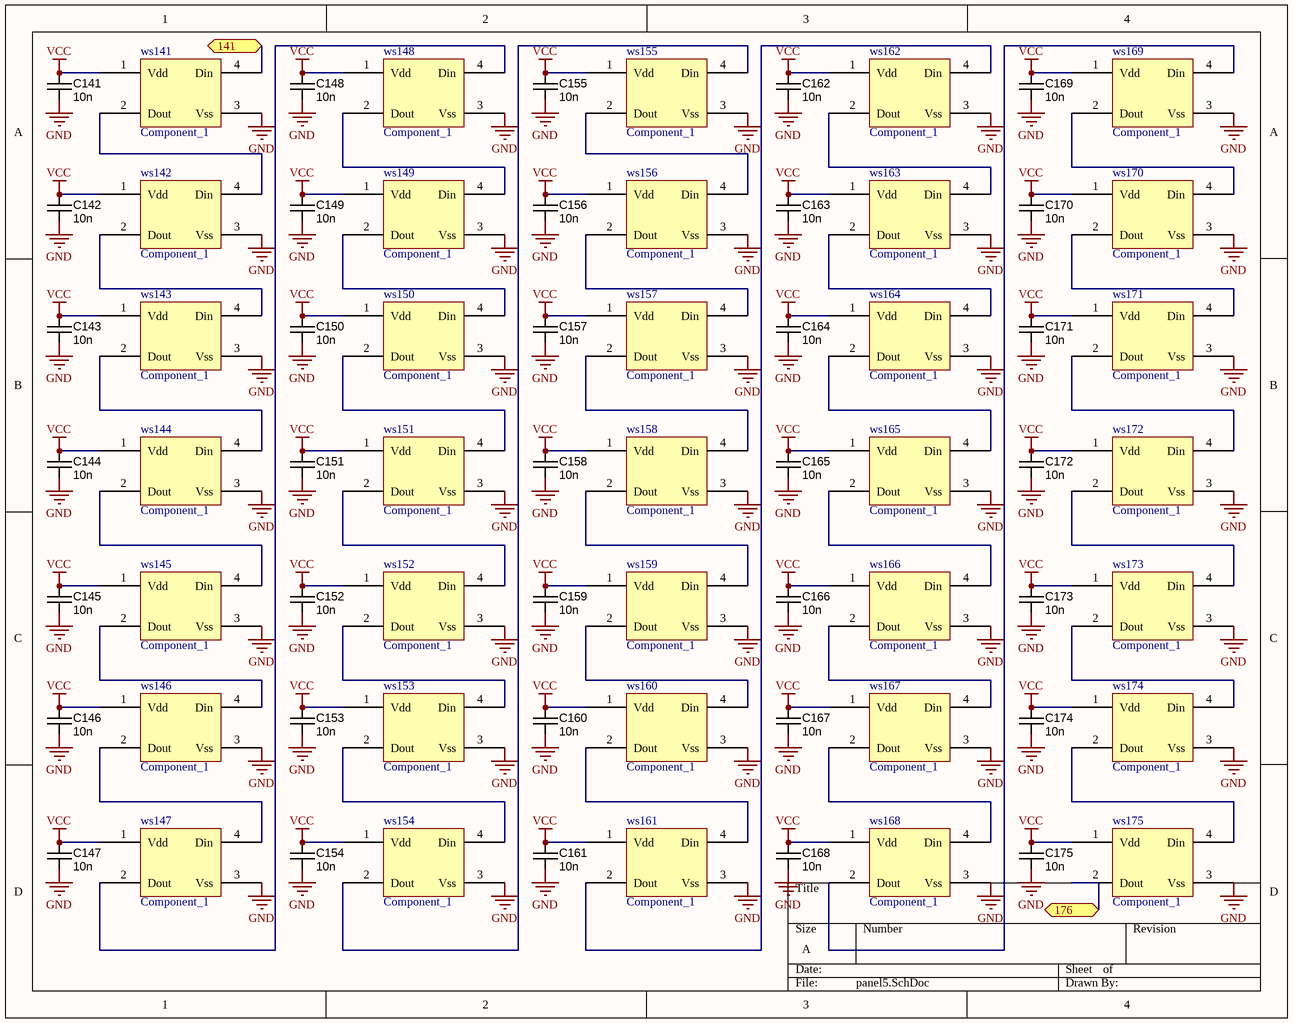
[diagram p4: panel5.SchDoc]

### Parts
C141  value 10n  [CAPC1608X90N]  (hidden comment: approved sub OK)
C142  value 10n  [CAPC1608X90N]  (hidden comment: approved sub OK)
C143  value 10n  [CAPC1608X90N]  (hidden comment: approved sub OK)
C144  value 10n  [CAPC1608X90N]  (hidden comment: approved sub OK)
C145  value 10n  [CAPC1608X90N]  (hidden comment: approved sub OK)
C146  value 10n  [CAPC1608X90N]  (hidden comment: approved sub OK)
C147  value 10n  [CAPC1608X90N]  (hidden comment: approved sub OK)
C148  value 10n  [CAPC1608X90N]  (hidden comment: approved sub OK)
C149  value 10n  [CAPC1608X90N]  (hidden comment: approved sub OK)
C150  value 10n  [CAPC1608X90N]  (hidden comment: approved sub OK)
C151  value 10n  [CAPC1608X90N]  (hidden comment: approved sub OK)
C152  value 10n  [CAPC1608X90N]  (hidden comment: approved sub OK)
C153  value 10n  [CAPC1608X90N]  (hidden comment: approved sub OK)
C154  value 10n  [CAPC1608X90N]  (hidden comment: approved sub OK)
C155  value 10n  [CAPC1608X90N]  (hidden comment: approved sub OK)
C156  value 10n  [CAPC1608X90N]  (hidden comment: approved sub OK)
C157  value 10n  [CAPC1608X90N]  (hidden comment: approved sub OK)
C158  value 10n  [CAPC1608X90N]  (hidden comment: approved sub OK)
C159  value 10n  [CAPC1608X90N]  (hidden comment: approved sub OK)
C160  value 10n  [CAPC1608X90N]  (hidden comment: approved sub OK)
C161  value 10n  [CAPC1608X90N]  (hidden comment: approved sub OK)
C162  value 10n  [CAPC1608X90N]  (hidden comment: approved sub OK)
C163  value 10n  [CAPC1608X90N]  (hidden comment: approved sub OK)
C164  value 10n  [CAPC1608X90N]  (hidden comment: approved sub OK)
C165  value 10n  [CAPC1608X90N]  (hidden comment: approved sub OK)
C166  value 10n  [CAPC1608X90N]  (hidden comment: approved sub OK)
C167  value 10n  [CAPC1608X90N]  (hidden comment: approved sub OK)
C168  value 10n  [CAPC1608X90N]  (hidden comment: approved sub OK)
C169  value 10n  [CAPC1608X90N]  (hidden comment: approved sub OK)
C170  value 10n  [CAPC1608X90N]  (hidden comment: approved sub OK)
C171  value 10n  [CAPC1608X90N]  (hidden comment: approved sub OK)
C172  value 10n  [CAPC1608X90N]  (hidden comment: approved sub OK)
C173  value 10n  [CAPC1608X90N]  (hidden comment: approved sub OK)
C174  value 10n  [CAPC1608X90N]  (hidden comment: approved sub OK)
C175  value 10n  [CAPC1608X90N]  (hidden comment: approved sub OK)
ws141  Component_1  [SOP4]
ws142  Component_1  [SOP4]
ws143  Component_1  [SOP4]
ws144  Component_1  [SOP4]
ws145  Component_1  [SOP4]
ws146  Component_1  [SOP4]
ws147  Component_1  [SOP4]
ws148  Component_1  [SOP4]
ws149  Component_1  [SOP4]
ws150  Component_1  [SOP4]
ws151  Component_1  [SOP4]
ws152  Component_1  [SOP4]
ws153  Component_1  [SOP4]
ws154  Component_1  [SOP4]
ws155  Component_1  [SOP4]
ws156  Component_1  [SOP4]
ws157  Component_1  [SOP4]
ws158  Component_1  [SOP4]
ws159  Component_1  [SOP4]
ws160  Component_1  [SOP4]
ws161  Component_1  [SOP4]
ws162  Component_1  [SOP4]
ws163  Component_1  [SOP4]
ws164  Component_1  [SOP4]
ws165  Component_1  [SOP4]
ws166  Component_1  [SOP4]
ws167  Component_1  [SOP4]
ws168  Component_1  [SOP4]
ws169  Component_1  [SOP4]
ws170  Component_1  [SOP4]
ws171  Component_1  [SOP4]
ws172  Component_1  [SOP4]
ws173  Component_1  [SOP4]
ws174  Component_1  [SOP4]
ws175  Component_1  [SOP4]

### Ports
141, 176

### Nets
GND: C141.2 C142.2 C143.2 C144.2 C145.2 C146.2 C147.2 C148.2 C149.2 C150.2 C151.2 C152.2 C153.2 C154.2 C155.2 C156.2 C157.2 C158.2 C159.2 C160.2 C161.2 C162.2 C163.2 C164.2 C165.2 C166.2 C167.2 C168.2 C169.2 C170.2 C171.2 C172.2 C173.2 C174.2 C175.2 ws141.3(Vss) ws142.3(Vss) ws143.3(Vss) ws144.3(Vss) ws145.3(Vss) ws146.3(Vss) ws147.3(Vss) ws148.3(Vss) ws149.3(Vss) ws150.3(Vss) ws151.3(Vss) ws152.3(Vss) ws153.3(Vss) ws154.3(Vss) ws155.3(Vss) ws156.3(Vss) ws157.3(Vss) ws158.3(Vss) ws159.3(Vss) ws160.3(Vss) ws161.3(Vss) ws162.3(Vss) ws163.3(Vss) ws164.3(Vss) ws165.3(Vss) ws166.3(Vss) ws167.3(Vss) ws168.3(Vss) ws169.3(Vss) ws170.3(Vss) ws171.3(Vss) ws172.3(Vss) ws173.3(Vss) ws174.3(Vss) ws175.3(Vss)
VCC: C141.1 C142.1 C143.1 C144.1 C145.1 C146.1 C147.1 C148.1 C149.1 C150.1 C151.1 C152.1 C153.1 C154.1 C155.1 C156.1 C157.1 C158.1 C159.1 C160.1 C161.1 C162.1 C163.1 C164.1 C165.1 C166.1 C167.1 C168.1 C169.1 C170.1 C171.1 C172.1 C173.1 C174.1 C175.1 ws141.1(Vdd) ws142.1(Vdd) ws143.1(Vdd) ws144.1(Vdd) ws145.1(Vdd) ws146.1(Vdd) ws147.1(Vdd) ws148.1(Vdd) ws149.1(Vdd) ws150.1(Vdd) ws151.1(Vdd) ws152.1(Vdd) ws153.1(Vdd) ws154.1(Vdd) ws155.1(Vdd) ws156.1(Vdd) ws157.1(Vdd) ws158.1(Vdd) ws159.1(Vdd) ws160.1(Vdd) ws161.1(Vdd) ws162.1(Vdd) ws163.1(Vdd) ws164.1(Vdd) ws165.1(Vdd) ws166.1(Vdd) ws167.1(Vdd) ws168.1(Vdd) ws169.1(Vdd) ws170.1(Vdd) ws171.1(Vdd) ws172.1(Vdd) ws173.1(Vdd) ws174.1(Vdd) ws175.1(Vdd)
Netws140_2: ws141.4(Din) ; port 141
Netws141_2: ws141.2(Dout) ws142.4(Din)
Netws142_2: ws142.2(Dout) ws143.4(Din)
Netws143_2: ws143.2(Dout) ws144.4(Din)
Netws144_2: ws144.2(Dout) ws145.4(Din)
Netws145_2: ws145.2(Dout) ws146.4(Din)
Netws146_2: ws146.2(Dout) ws147.4(Din)
Netws147_2: ws147.2(Dout) ws148.4(Din)
Netws148_2: ws148.2(Dout) ws149.4(Din)
Netws149_2: ws149.2(Dout) ws150.4(Din)
Netws150_2: ws150.2(Dout) ws151.4(Din)
Netws151_2: ws151.2(Dout) ws152.4(Din)
Netws152_2: ws152.2(Dout) ws153.4(Din)
Netws153_2: ws153.2(Dout) ws154.4(Din)
Netws154_2: ws154.2(Dout) ws155.4(Din)
Netws155_2: ws155.2(Dout) ws156.4(Din)
Netws156_2: ws156.2(Dout) ws157.4(Din)
Netws157_2: ws157.2(Dout) ws158.4(Din)
Netws158_2: ws158.2(Dout) ws159.4(Din)
Netws159_2: ws159.2(Dout) ws160.4(Din)
Netws160_2: ws160.2(Dout) ws161.4(Din)
Netws161_2: ws161.2(Dout) ws162.4(Din)
Netws162_2: ws162.2(Dout) ws163.4(Din)
Netws163_2: ws163.2(Dout) ws164.4(Din)
Netws164_2: ws164.2(Dout) ws165.4(Din)
Netws165_2: ws165.2(Dout) ws166.4(Din)
Netws166_2: ws166.2(Dout) ws167.4(Din)
Netws167_2: ws167.2(Dout) ws168.4(Din)
Netws168_2: ws168.2(Dout) ws169.4(Din)
Netws169_2: ws169.2(Dout) ws170.4(Din)
Netws170_2: ws170.2(Dout) ws171.4(Din)
Netws171_2: ws171.2(Dout) ws172.4(Din)
Netws172_2: ws172.2(Dout) ws173.4(Din)
Netws173_2: ws173.2(Dout) ws174.4(Din)
Netws174_2: ws174.2(Dout) ws175.4(Din)
Netws175_2: ws175.2(Dout) ; port 176

### Library data of the parts
C141-C175 = CAPC_10n_0603_X7R_100V_10%: as C1 on sheet panel; Package / Case: 0603 (1608 metric); Tolerance: ±10%; Supplier 1: Digi-Key; Supplier Part Number 1: 490-4781-1-ND

## Sheet panel6.SchDoc
size A
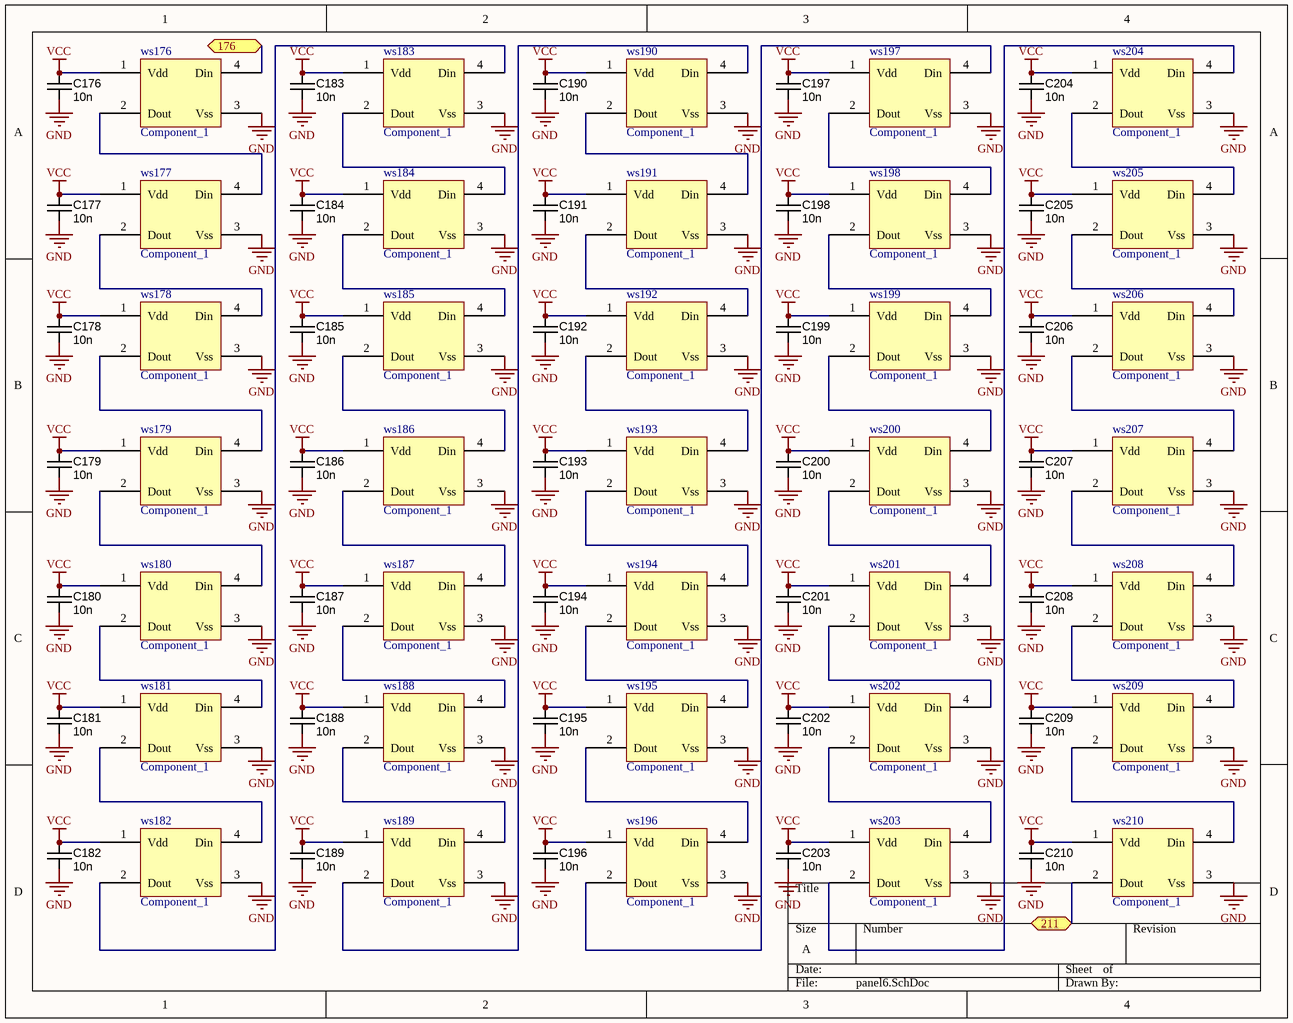
[diagram p5: panel6.SchDoc]

### Parts
C176  value 10n  [CAPC1608X90N]  (hidden comment: approved sub OK)
C177  value 10n  [CAPC1608X90N]  (hidden comment: approved sub OK)
C178  value 10n  [CAPC1608X90N]  (hidden comment: approved sub OK)
C179  value 10n  [CAPC1608X90N]  (hidden comment: approved sub OK)
C180  value 10n  [CAPC1608X90N]  (hidden comment: approved sub OK)
C181  value 10n  [CAPC1608X90N]  (hidden comment: approved sub OK)
C182  value 10n  [CAPC1608X90N]  (hidden comment: approved sub OK)
C183  value 10n  [CAPC1608X90N]  (hidden comment: approved sub OK)
C184  value 10n  [CAPC1608X90N]  (hidden comment: approved sub OK)
C185  value 10n  [CAPC1608X90N]  (hidden comment: approved sub OK)
C186  value 10n  [CAPC1608X90N]  (hidden comment: approved sub OK)
C187  value 10n  [CAPC1608X90N]  (hidden comment: approved sub OK)
C188  value 10n  [CAPC1608X90N]  (hidden comment: approved sub OK)
C189  value 10n  [CAPC1608X90N]  (hidden comment: approved sub OK)
C190  value 10n  [CAPC1608X90N]  (hidden comment: approved sub OK)
C191  value 10n  [CAPC1608X90N]  (hidden comment: approved sub OK)
C192  value 10n  [CAPC1608X90N]  (hidden comment: approved sub OK)
C193  value 10n  [CAPC1608X90N]  (hidden comment: approved sub OK)
C194  value 10n  [CAPC1608X90N]  (hidden comment: approved sub OK)
C195  value 10n  [CAPC1608X90N]  (hidden comment: approved sub OK)
C196  value 10n  [CAPC1608X90N]  (hidden comment: approved sub OK)
C197  value 10n  [CAPC1608X90N]  (hidden comment: approved sub OK)
C198  value 10n  [CAPC1608X90N]  (hidden comment: approved sub OK)
C199  value 10n  [CAPC1608X90N]  (hidden comment: approved sub OK)
C200  value 10n  [CAPC1608X90N]  (hidden comment: approved sub OK)
C201  value 10n  [CAPC1608X90N]  (hidden comment: approved sub OK)
C202  value 10n  [CAPC1608X90N]  (hidden comment: approved sub OK)
C203  value 10n  [CAPC1608X90N]  (hidden comment: approved sub OK)
C204  value 10n  [CAPC1608X90N]  (hidden comment: approved sub OK)
C205  value 10n  [CAPC1608X90N]  (hidden comment: approved sub OK)
C206  value 10n  [CAPC1608X90N]  (hidden comment: approved sub OK)
C207  value 10n  [CAPC1608X90N]  (hidden comment: approved sub OK)
C208  value 10n  [CAPC1608X90N]  (hidden comment: approved sub OK)
C209  value 10n  [CAPC1608X90N]  (hidden comment: approved sub OK)
C210  value 10n  [CAPC1608X90N]  (hidden comment: approved sub OK)
ws176  Component_1  [SOP4]
ws177  Component_1  [SOP4]
ws178  Component_1  [SOP4]
ws179  Component_1  [SOP4]
ws180  Component_1  [SOP4]
ws181  Component_1  [SOP4]
ws182  Component_1  [SOP4]
ws183  Component_1  [SOP4]
ws184  Component_1  [SOP4]
ws185  Component_1  [SOP4]
ws186  Component_1  [SOP4]
ws187  Component_1  [SOP4]
ws188  Component_1  [SOP4]
ws189  Component_1  [SOP4]
ws190  Component_1  [SOP4]
ws191  Component_1  [SOP4]
ws192  Component_1  [SOP4]
ws193  Component_1  [SOP4]
ws194  Component_1  [SOP4]
ws195  Component_1  [SOP4]
ws196  Component_1  [SOP4]
ws197  Component_1  [SOP4]
ws198  Component_1  [SOP4]
ws199  Component_1  [SOP4]
ws200  Component_1  [SOP4]
ws201  Component_1  [SOP4]
ws202  Component_1  [SOP4]
ws203  Component_1  [SOP4]
ws204  Component_1  [SOP4]
ws205  Component_1  [SOP4]
ws206  Component_1  [SOP4]
ws207  Component_1  [SOP4]
ws208  Component_1  [SOP4]
ws209  Component_1  [SOP4]
ws210  Component_1  [SOP4]

### Ports
176, 211

### Nets
GND: C176.2 C177.2 C178.2 C179.2 C180.2 C181.2 C182.2 C183.2 C184.2 C185.2 C186.2 C187.2 C188.2 C189.2 C190.2 C191.2 C192.2 C193.2 C194.2 C195.2 C196.2 C197.2 C198.2 C199.2 C200.2 C201.2 C202.2 C203.2 C204.2 C205.2 C206.2 C207.2 C208.2 C209.2 C210.2 ws176.3(Vss) ws177.3(Vss) ws178.3(Vss) ws179.3(Vss) ws180.3(Vss) ws181.3(Vss) ws182.3(Vss) ws183.3(Vss) ws184.3(Vss) ws185.3(Vss) ws186.3(Vss) ws187.3(Vss) ws188.3(Vss) ws189.3(Vss) ws190.3(Vss) ws191.3(Vss) ws192.3(Vss) ws193.3(Vss) ws194.3(Vss) ws195.3(Vss) ws196.3(Vss) ws197.3(Vss) ws198.3(Vss) ws199.3(Vss) ws200.3(Vss) ws201.3(Vss) ws202.3(Vss) ws203.3(Vss) ws204.3(Vss) ws205.3(Vss) ws206.3(Vss) ws207.3(Vss) ws208.3(Vss) ws209.3(Vss) ws210.3(Vss)
VCC: C176.1 C177.1 C178.1 C179.1 C180.1 C181.1 C182.1 C183.1 C184.1 C185.1 C186.1 C187.1 C188.1 C189.1 C190.1 C191.1 C192.1 C193.1 C194.1 C195.1 C196.1 C197.1 C198.1 C199.1 C200.1 C201.1 C202.1 C203.1 C204.1 C205.1 C206.1 C207.1 C208.1 C209.1 C210.1 ws176.1(Vdd) ws177.1(Vdd) ws178.1(Vdd) ws179.1(Vdd) ws180.1(Vdd) ws181.1(Vdd) ws182.1(Vdd) ws183.1(Vdd) ws184.1(Vdd) ws185.1(Vdd) ws186.1(Vdd) ws187.1(Vdd) ws188.1(Vdd) ws189.1(Vdd) ws190.1(Vdd) ws191.1(Vdd) ws192.1(Vdd) ws193.1(Vdd) ws194.1(Vdd) ws195.1(Vdd) ws196.1(Vdd) ws197.1(Vdd) ws198.1(Vdd) ws199.1(Vdd) ws200.1(Vdd) ws201.1(Vdd) ws202.1(Vdd) ws203.1(Vdd) ws204.1(Vdd) ws205.1(Vdd) ws206.1(Vdd) ws207.1(Vdd) ws208.1(Vdd) ws209.1(Vdd) ws210.1(Vdd)
Netws175_2: ws176.4(Din) ; port 176
Netws176_2: ws176.2(Dout) ws177.4(Din)
Netws177_2: ws177.2(Dout) ws178.4(Din)
Netws178_2: ws178.2(Dout) ws179.4(Din)
Netws179_2: ws179.2(Dout) ws180.4(Din)
Netws180_2: ws180.2(Dout) ws181.4(Din)
Netws181_2: ws181.2(Dout) ws182.4(Din)
Netws182_2: ws182.2(Dout) ws183.4(Din)
Netws183_2: ws183.2(Dout) ws184.4(Din)
Netws184_2: ws184.2(Dout) ws185.4(Din)
Netws185_2: ws185.2(Dout) ws186.4(Din)
Netws186_2: ws186.2(Dout) ws187.4(Din)
Netws187_2: ws187.2(Dout) ws188.4(Din)
Netws188_2: ws188.2(Dout) ws189.4(Din)
Netws189_2: ws189.2(Dout) ws190.4(Din)
Netws190_2: ws190.2(Dout) ws191.4(Din)
Netws191_2: ws191.2(Dout) ws192.4(Din)
Netws192_2: ws192.2(Dout) ws193.4(Din)
Netws193_2: ws193.2(Dout) ws194.4(Din)
Netws194_2: ws194.2(Dout) ws195.4(Din)
Netws195_2: ws195.2(Dout) ws196.4(Din)
Netws196_2: ws196.2(Dout) ws197.4(Din)
Netws197_2: ws197.2(Dout) ws198.4(Din)
Netws198_2: ws198.2(Dout) ws199.4(Din)
Netws199_2: ws199.2(Dout) ws200.4(Din)
Netws200_2: ws200.2(Dout) ws201.4(Din)
Netws201_2: ws201.2(Dout) ws202.4(Din)
Netws202_2: ws202.2(Dout) ws203.4(Din)
Netws203_2: ws203.2(Dout) ws204.4(Din)
Netws204_2: ws204.2(Dout) ws205.4(Din)
Netws205_2: ws205.2(Dout) ws206.4(Din)
Netws206_2: ws206.2(Dout) ws207.4(Din)
Netws207_2: ws207.2(Dout) ws208.4(Din)
Netws208_2: ws208.2(Dout) ws209.4(Din)
Netws209_2: ws209.2(Dout) ws210.4(Din)
Netws210_2: ws210.2(Dout) ; port 211

### Library data of the parts
C176-C210 = CAPC_10n_0603_X7R_100V_10%: as C1 on sheet panel; Package / Case: 0603 (1608 metric); Tolerance: ±10%; Supplier 1: Digi-Key; Supplier Part Number 1: 490-4781-1-ND

## Sheet panel7.SchDoc
size A
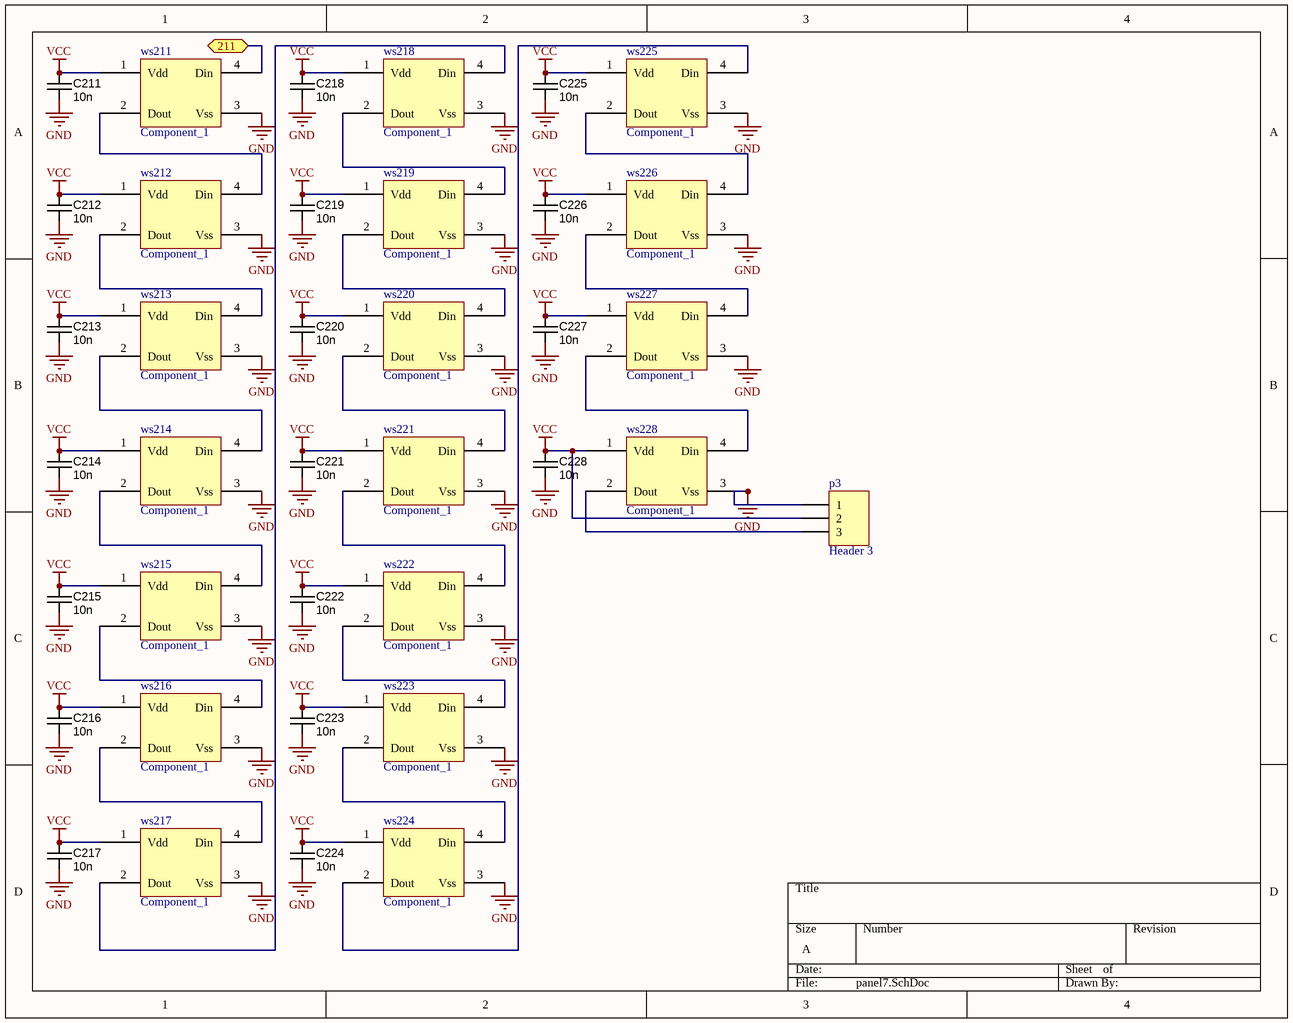
[diagram p6: panel7.SchDoc]

### Parts
C211  value 10n  [CAPC1608X90N]  (hidden comment: approved sub OK)
C212  value 10n  [CAPC1608X90N]  (hidden comment: approved sub OK)
C213  value 10n  [CAPC1608X90N]  (hidden comment: approved sub OK)
C214  value 10n  [CAPC1608X90N]  (hidden comment: approved sub OK)
C215  value 10n  [CAPC1608X90N]  (hidden comment: approved sub OK)
C216  value 10n  [CAPC1608X90N]  (hidden comment: approved sub OK)
C217  value 10n  [CAPC1608X90N]  (hidden comment: approved sub OK)
C218  value 10n  [CAPC1608X90N]  (hidden comment: approved sub OK)
C219  value 10n  [CAPC1608X90N]  (hidden comment: approved sub OK)
C220  value 10n  [CAPC1608X90N]  (hidden comment: approved sub OK)
C221  value 10n  [CAPC1608X90N]  (hidden comment: approved sub OK)
C222  value 10n  [CAPC1608X90N]  (hidden comment: approved sub OK)
C223  value 10n  [CAPC1608X90N]  (hidden comment: approved sub OK)
C224  value 10n  [CAPC1608X90N]  (hidden comment: approved sub OK)
C225  value 10n  [CAPC1608X90N]  (hidden comment: approved sub OK)
C226  value 10n  [CAPC1608X90N]  (hidden comment: approved sub OK)
C227  value 10n  [CAPC1608X90N]  (hidden comment: approved sub OK)
C228  value 10n  [CAPC1608X90N]  (hidden comment: approved sub OK)
p3  Header 3  [HDR1X3]
ws211  Component_1  [SOP4]
ws212  Component_1  [SOP4]
ws213  Component_1  [SOP4]
ws214  Component_1  [SOP4]
ws215  Component_1  [SOP4]
ws216  Component_1  [SOP4]
ws217  Component_1  [SOP4]
ws218  Component_1  [SOP4]
ws219  Component_1  [SOP4]
ws220  Component_1  [SOP4]
ws221  Component_1  [SOP4]
ws222  Component_1  [SOP4]
ws223  Component_1  [SOP4]
ws224  Component_1  [SOP4]
ws225  Component_1  [SOP4]
ws226  Component_1  [SOP4]
ws227  Component_1  [SOP4]
ws228  Component_1  [SOP4]

### Ports
211

### Nets
GND: C211.2 C212.2 C213.2 C214.2 C215.2 C216.2 C217.2 C218.2 C219.2 C220.2 C221.2 C222.2 C223.2 C224.2 C225.2 C226.2 C227.2 C228.2 p3.1 ws211.3(Vss) ws212.3(Vss) ws213.3(Vss) ws214.3(Vss) ws215.3(Vss) ws216.3(Vss) ws217.3(Vss) ws218.3(Vss) ws219.3(Vss) ws220.3(Vss) ws221.3(Vss) ws222.3(Vss) ws223.3(Vss) ws224.3(Vss) ws225.3(Vss) ws226.3(Vss) ws227.3(Vss) ws228.3(Vss)
VCC: C211.1 C212.1 C213.1 C214.1 C215.1 C216.1 C217.1 C218.1 C219.1 C220.1 C221.1 C222.1 C223.1 C224.1 C225.1 C226.1 C227.1 C228.1 p3.2 ws211.1(Vdd) ws212.1(Vdd) ws213.1(Vdd) ws214.1(Vdd) ws215.1(Vdd) ws216.1(Vdd) ws217.1(Vdd) ws218.1(Vdd) ws219.1(Vdd) ws220.1(Vdd) ws221.1(Vdd) ws222.1(Vdd) ws223.1(Vdd) ws224.1(Vdd) ws225.1(Vdd) ws226.1(Vdd) ws227.1(Vdd) ws228.1(Vdd)
Netp3_3: p3.3 ws228.2(Dout)
Netws210_2: ws211.4(Din) ; port 211
Netws211_2: ws211.2(Dout) ws212.4(Din)
Netws212_2: ws212.2(Dout) ws213.4(Din)
Netws213_2: ws213.2(Dout) ws214.4(Din)
Netws214_2: ws214.2(Dout) ws215.4(Din)
Netws215_2: ws215.2(Dout) ws216.4(Din)
Netws216_2: ws216.2(Dout) ws217.4(Din)
Netws217_2: ws217.2(Dout) ws218.4(Din)
Netws218_2: ws218.2(Dout) ws219.4(Din)
Netws219_2: ws219.2(Dout) ws220.4(Din)
Netws220_2: ws220.2(Dout) ws221.4(Din)
Netws221_2: ws221.2(Dout) ws222.4(Din)
Netws222_2: ws222.2(Dout) ws223.4(Din)
Netws223_2: ws223.2(Dout) ws224.4(Din)
Netws224_2: ws224.2(Dout) ws225.4(Din)
Netws225_2: ws225.2(Dout) ws226.4(Din)
Netws226_2: ws226.2(Dout) ws227.4(Din)
Netws227_2: ws227.2(Dout) ws228.4(Din)

### Library data of the parts
C211-C228 = CAPC_10n_0603_X7R_100V_10%: as C1 on sheet panel; Package / Case: 0603 (1608 metric); Tolerance: ±10%; Supplier 1: Digi-Key; Supplier Part Number 1: 490-4781-1-ND
p3 = Header 3: Header, 3-Pin; LatestRevisionDate: 17-Jul-2002; LatestRevisionNote: Re-released for DXP Platform.; Publisher: Altium Limited

## Nets that join several sheets
GND: panel (71 pins), panel2 (70 pins), panel3 (70 pins), panel4 (70 pins), panel5 (70 pins), panel6 (70 pins), panel7 (37 pins)
VCC: panel (71 pins), panel2 (70 pins), panel3 (70 pins), panel4 (70 pins), panel5 (70 pins), panel6 (70 pins), panel7 (37 pins)
Netws35_2: panel (ws35.2), panel2 (ws36.4)
Netws70_2: panel2 (ws70.2), panel3 (ws71.4)
Netws105_2: panel3 (ws105.2), panel4 (ws106.4)
Netws140_2: panel4 (ws140.2), panel5 (ws141.4)
Netws175_2: panel5 (ws175.2), panel6 (ws176.4)
Netws210_2: panel6 (ws210.2), panel7 (ws211.4)